# Altium schematic sheet 99_CAN_Interface.SchDoc
size A4
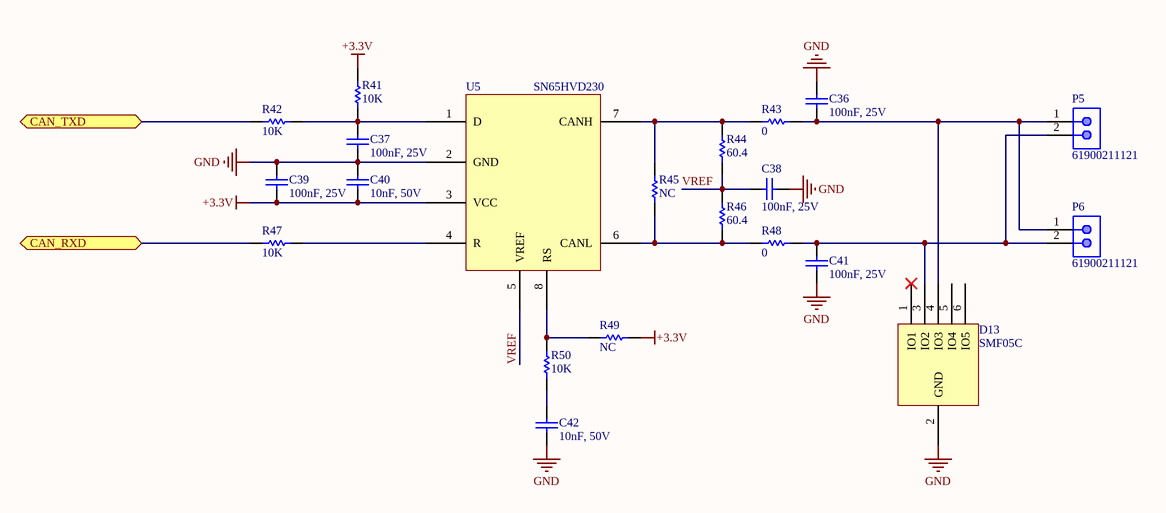
[diagram p0: 99_CAN_Interface.SchDoc]

## Parts
C36  100nF, 25V  [WCAP-CSGP_0603_H=0.8mm_Reflow]
C37  100nF, 25V  [WCAP-CSGP_0603_H=0.8mm_Reflow]
C38  100nF, 25V  [WCAP-CSGP_0603_H=0.8mm_Reflow]
C39  100nF, 25V  [WCAP-CSGP_0603_H=0.8mm_Reflow]
C40  10nF, 50V  [WCAP-CSGP_0603_H=0.8mm_Reflow]
C41  100nF, 25V  [WCAP-CSGP_0603_H=0.8mm_Reflow]
C42  10nF, 50V  [WCAP-CSGP_0603_H=0.8mm_Reflow]
D13  SMF05C  [SOT65P210X110-6N]
P5  61900211121  [61900211121]
P6  61900211121  [61900211121]
R41  value 10K  [RES-SM-0603]  (hidden comment: RESISTOR SMD)
R42  value 10K  [RES-SM-0603]  (hidden comment: RESISTOR SMD)
R43  value 0  [RES-SM-0603]  (hidden comment: RESISTOR SMD)
R44  value 60.4  [RES-SM-0603]  (hidden comment: RESISTOR SMD)
R45  value NC  [RES-SM-0603]  (hidden comment: RESISTOR SMD)
R46  value 60.4  [RES-SM-0603]  (hidden comment: RESISTOR SMD)
R47  value 10K  [RES-SM-0603]  (hidden comment: RESISTOR SMD)
R48  value 0  [RES-SM-0603]  (hidden comment: RESISTOR SMD)
R49  value NC  [RES-SM-0603]  (hidden comment: RESISTOR SMD)
R50  value 10K  [RES-SM-0603]  (hidden comment: RESISTOR SMD)
U5  SN65HVD230  [SOIC127P600X175-8N]

## Ports
CAN_RXD (bidir), CAN_TXD (bidir)

## Nets
+3.3V: C39.1 C40.1 R41.2 R49.1 U5.3(VCC)
GND: C36.2 C37.1 C38.1 C39.2 C40.2 C41.1 C42.1 D13.2(GND) U5.2(GND)
CAN_RXD: R47.2 ; port CAN_RXD
CAN_TXD: R42.2 ; port CAN_TXD
VREF: C38.2 R44.2 R46.1 U5.5(VREF)
NetC36_1: C36.1 D13.4(IO3) P5.1 P6.1 R43.1
NetC37_2: C37.2 R41.1 R42.1 U5.1(D)
NetC41_2: C41.2 D13.3(IO2) P5.2 P6.2 R48.1
NetC42_2: C42.2 R50.1
NetR43_2: R43.2 R44.1 R45.1 U5.7(CANH)
NetR45_2: R45.2 R46.2 R48.2 U5.6(CANL)
NetR47_1: R47.1 U5.4(R)
NetR49_2: R49.2 R50.2 U5.8(RS)

Not connected (* = marked no-connect by the designer): D13 1(IO1)* 5(IO4) 6(IO5)

## Library data of the parts
C36-C39 C41 = 885012206071: WCAP-CSGP Multilayer Ceramic Chip Capacitor, General Purpose, size 0603, X7R, 100nF, 25V; Manufacturer: Wurth Elektronik; Rated Voltage: 25VDC; Isolation Resistance: >=5GOhm; Capacitance Tolerance: +/-10%; Technical Reference: X7R0603104K025DFCT10000; ComponentLink1Description: Manufacturer; ComponentLink1URL: http://www.we-online.de; ComponentLink2Description: Datasheet; ComponentLink2URL: https://www.we-online.com/catalog/datasheet/885012206071.pdf; Operating Temperature: -55 to +125degC; Packaging: Tape and Reel; Manufacturer Part Number: 885012206071; Published Date: May 2020; Ceramic Type: X7R; Dissipation Factor: =<3.5%; Height: 0.8mm; Mounting Technology: SMT; Size: 0603; Capacitance: 100nF
C40 C42 = 885012206089: WCAP-CSGP Multilayer Ceramic Chip Capacitor, General Purpose, size 0603, X7R, 10nF, 50V; Manufacturer: Wurth Elektronik; Rated Voltage: 50VDC; Isolation Resistance: >=10GOhm; Capacitance Tolerance: +/-10%; Technical Reference: X7R0603103K050DFCT10000; ComponentLink1Description: Manufacturer; ComponentLink1URL: http://www.we-online.de; ComponentLink2Description: Datasheet; ComponentLink2URL: https://www.we-online.com/catalog/datasheet/885012206089.pdf; Operating Temperature: -55 to +125degC; Packaging: Tape and Reel; Manufacturer Part Number: 885012206089; Published Date: May 2020; Ceramic Type: X7R; Dissipation Factor: =<2.5%; Height: 0.8mm; Mounting Technology: SMT; Size: 0603; Capacitance: 10nF
P5 P6 = 61900211121: WR-WTB THT Male Vertical Locking Header, pitch 2.54mm, 2p; Pin Number: 2; Contact Resistance: 20mOhm; Rated Current: 3A; Withstanding Voltage: 1000VAC; Working Voltage: 250VAC; ComponentLink1Description: Manufacturer; ComponentLink1URL: http://www.we-online.de; ComponentLink2Description: Datasheet; ComponentLink2URL: https://www.we-online.com/catalog/datasheet/61900211121.pdf; Pitch: 2.54mm; Published Date: January 2020; Publisher: Wurth Elektronik; Mounting Technology: THT; Packaging: Bag; Operating Temperature: -40 to +105degC; Part Number: 61900211121; Gender: Male; Type: Vertical
R41-R50 = RESISTOR SMD: Resistor